# EAGLE schematic clock (EAGLE 7.3.0)
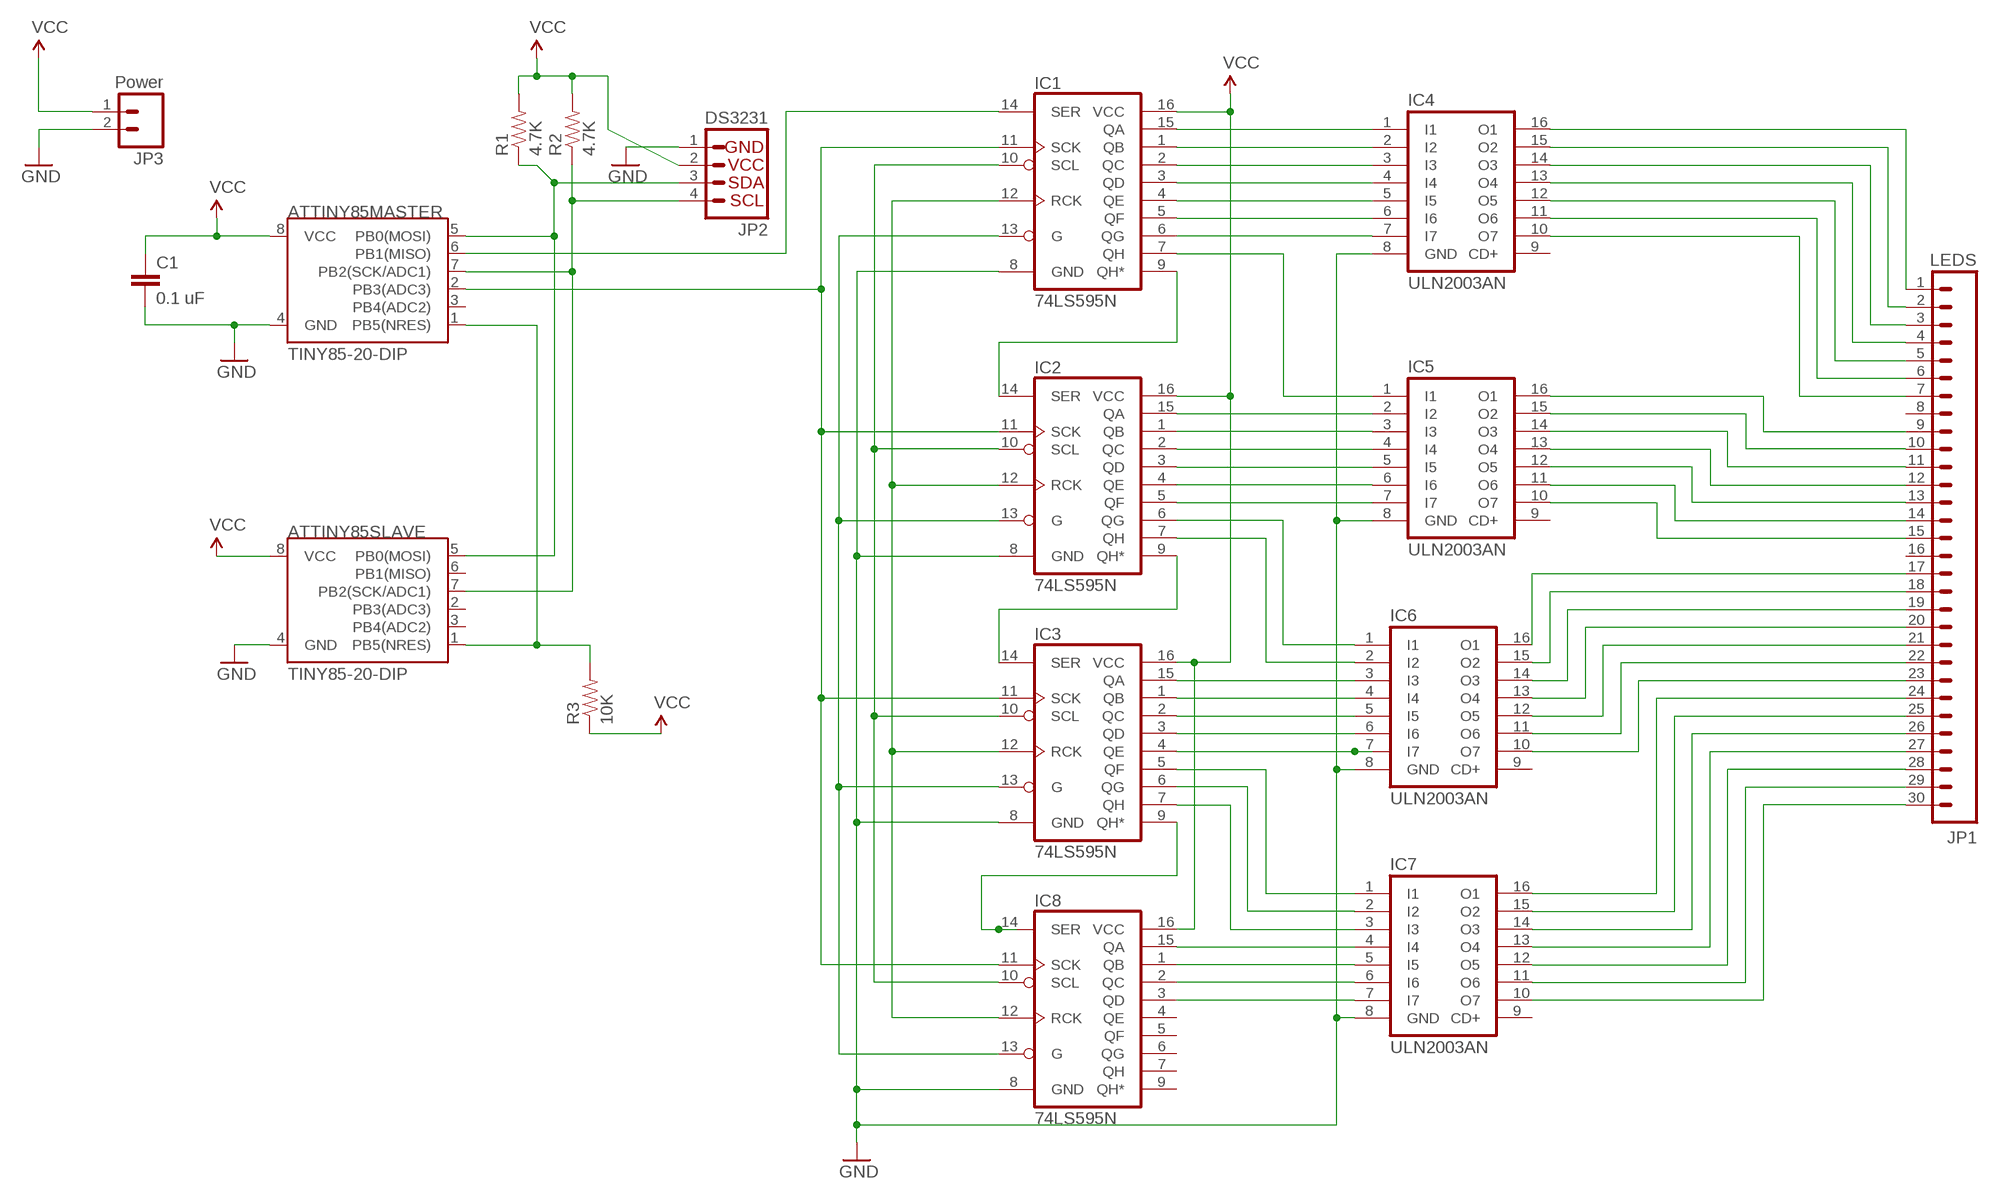
[diagram p0: schematic, sheet 1]

## Parts
ATTINY85MASTER  TINY85-20-DIP  ATTINY45TINY85-20-DIP  [DIP08]
ATTINY85SLAVE  TINY85-20-DIP  ATTINY45TINY85-20-DIP  [DIP08]
C1  0.1 uF  CAPPTH  [CAP-PTH-SMALL]
IC1  74LS595N  [DIL16]
IC2  74LS595N  [DIL16]
IC3  74LS595N  [DIL16]
IC4  ULN2003AN  [DIL16]
IC5  ULN2003AN  [DIL16]
IC6  ULN2003AN  [DIL16]
IC7  ULN2003AN  [DIL16]
IC8  74LS595N  [DIL16]
JP1  LEDS  M30  [1X30]
JP2  DS3231  I2C_STANDARD  [1X04]
JP3  Power  M02PTH3  [1X02_LONGPADS]
R1  4.7K  RESISTORPTH-1/4W  [AXIAL-0.4]
R2  4.7K  RESISTORPTH-1/4W  [AXIAL-0.4]
R3  10K  RESISTORPTH-1/4W  [AXIAL-0.4]

## Nets
GND: ATTINY85MASTER.4(GND) ATTINY85SLAVE.4(GND) C1.2 IC1.8(GND) IC2.8(GND) IC3.8(GND) IC4.8(GND) IC5.8(GND) IC6.8(GND) IC7.8(GND) IC8.8(GND) JP2.1 JP3.2
HALF: IC4.15(O2) JP1.2
N$1: ATTINY85MASTER.5(PB0(MOSI)) ATTINY85SLAVE.5(PB0(MOSI)) JP2.3 R1.P$1
N$2: ATTINY85MASTER.7(PB2(SCK/ADC1)) ATTINY85SLAVE.7(PB2(SCK/ADC1)) JP2.4 R2.P$1
N$3: IC1.9(QH*) IC2.14(SER)
N$4: IC1.13(G) IC2.13(G) IC3.13(G) IC8.13(G)
N$5: IC2.9(QH*) IC3.14(SER)
N$6: ATTINY85MASTER.1(PB5(NRES)) ATTINY85SLAVE.1(PB5(NRES)) R3.P$2
N$7: IC1.15(QA) IC4.1(I1)
N$8: IC1.1(QB) IC4.2(I2)
N$9: IC1.2(QC) IC4.3(I3)
N$10: IC1.3(QD) IC4.4(I4)
N$11: IC1.4(QE) IC4.5(I5)
N$12: IC1.5(QF) IC4.6(I6)
N$13: IC1.6(QG) IC4.7(I7)
N$14: ATTINY85MASTER.6(PB1(MISO)) IC1.14(SER)
N$15: IC1.7(QH) IC5.1(I1)
N$16: IC2.15(QA) IC5.2(I2)
N$17: IC2.1(QB) IC5.3(I3)
N$18: IC2.2(QC) IC5.4(I4)
N$19: IC2.3(QD) IC5.5(I5)
N$20: IC2.4(QE) IC5.6(I6)
N$21: IC2.5(QF) IC5.7(I7)
N$22: IC2.7(QH) IC6.2(I2)
N$23: IC2.6(QG) IC6.1(I1)
N$24: IC3.15(QA) IC6.3(I3)
N$25: IC3.1(QB) IC6.4(I4)
N$26: IC3.2(QC) IC6.5(I5)
N$27: IC3.3(QD) IC6.6(I6)
N$28: IC3.4(QE) IC6.7(I7)
N$29: IC3.9(QH*) IC8.14(SER)
N$30: IC7.4(I4) IC8.15(QA)
N$31: IC7.5(I5) IC8.1(QB)
N$32: IC7.6(I6) IC8.2(QC)
N$33: IC7.7(I7) IC8.3(QD)
N$34: IC3.5(QF) IC7.1(I1)
N$35: IC3.6(QG) IC7.2(I2)
N$36: IC3.7(QH) IC7.3(I3)
N$37: IC1.10(SCL) IC2.10(SCL) IC3.10(SCL) IC8.10(SCL)
N$38: IC1.12(RCK) IC2.12(RCK) IC3.12(RCK) IC8.12(RCK)
N$39: IC4.14(O3) JP1.3
N$40: IC4.13(O4) JP1.4
N$41: IC4.12(O5) JP1.5
N$42: IC4.11(O6) JP1.6
N$43: IC4.10(O7) JP1.7
N$44: ATTINY85MASTER.2(PB3(ADC3)) IC1.11(SCK) IC2.11(SCK) IC3.11(SCK) IC8.11(SCK)
N$45: IC5.16(O1) JP1.9
N$46: IC5.15(O2) JP1.10
N$47: IC5.14(O3) JP1.11
N$48: IC5.13(O4) JP1.12
N$49: IC5.12(O5) JP1.13
N$50: IC5.11(O6) JP1.14
N$51: IC5.10(O7) JP1.15
N$52: IC7.16(O1) JP1.24
N$53: IC6.16(O1) JP1.17
N$54: IC6.15(O2) JP1.18
N$55: IC6.14(O3) JP1.19
N$56: IC6.13(O4) JP1.20
N$57: IC6.12(O5) JP1.21
N$58: IC6.11(O6) JP1.22
N$59: IC6.10(O7) JP1.23
N$60: IC7.15(O2) JP1.25
N$61: IC7.14(O3) JP1.26
N$62: IC7.13(O4) JP1.27
N$63: IC7.12(O5) JP1.28
N$64: IC7.11(O6) JP1.29
N$65: IC7.10(O7) JP1.30
TEN: IC4.16(O1) JP1.1
VCC: ATTINY85MASTER.8(VCC) ATTINY85SLAVE.8(VCC) C1.1 IC1.16(VCC) IC2.16(VCC) IC3.16(VCC) IC8.16(VCC) JP2.2 JP3.1 R1.P$2 R2.P$2 R3.P$1
Unconnected: ATTINY85MASTER.3(PB4(ADC2)) ATTINY85SLAVE.2(PB3(ADC3)) ATTINY85SLAVE.3(PB4(ADC2)) ATTINY85SLAVE.6(PB1(MISO)) IC4.9(CD+) IC5.9(CD+) IC6.9(CD+) IC7.9(CD+) IC8.4(QE) IC8.5(QF) IC8.6(QG) IC8.7(QH) IC8.9(QH*) JP1.8 JP1.16

## Library data of the parts
ATTINY85MASTER ATTINY85SLAVE = SparkFun-DigitalIC:ATTINY45: Atmel 8-pin 2/4/8kB flash uC; PROD_ID: IC-09445
C1 = SparkFun-Capacitors:CAP: Capacitor Standard 0603 ceramic capacitor, and 0.1" leaded capacitor.
IC1-IC3 IC8 = SparkFun-DigitalIC:74*595: 8-bit SHIFT REGISTER, output latch
IC4-IC7 = uln-udn:ULN2003A: DRIVER ARRAY
JP1 = SparkFun-Connectors:M30: 1x30 .1" header
JP2 = SparkFun-Connectors:I2C_STANDARD: SparkFun has standardized on a pinout for all I2C based sensor breakouts. This pinout allows I2C boards to be plugged directly into the headers on Arduino Uno compatible boards, and to be daisy chained easily.
JP3 = SparkFun-Connectors:M02: Standard 2-pin 0.1" header. Use with - straight break away headers ( PRT-00116) - right angle break away headers (PRT-00553) - swiss pins (PRT-00743) - machine pins (PRT-00117) - female headers (PRT-00115) Molex polarized connector foot print use with: PRT-08233 with associated crimp pins and housings. 2.54_SCREWTERM for use with PRT-10571. 3.5mm Screw Terminal footprints for PRT-08084 5mm Screw Terminal footprints for use with PRT-08432
R1-R3 = SparkFun-Resistors:RESISTOR: Resistor Basic schematic elements and footprints for 0603, 1206, and PTH resistors.